# EAGLE design RT-E MainBoard Rev 1b (EAGLE 6.5.0)

## Sheet 1 of 4: Power
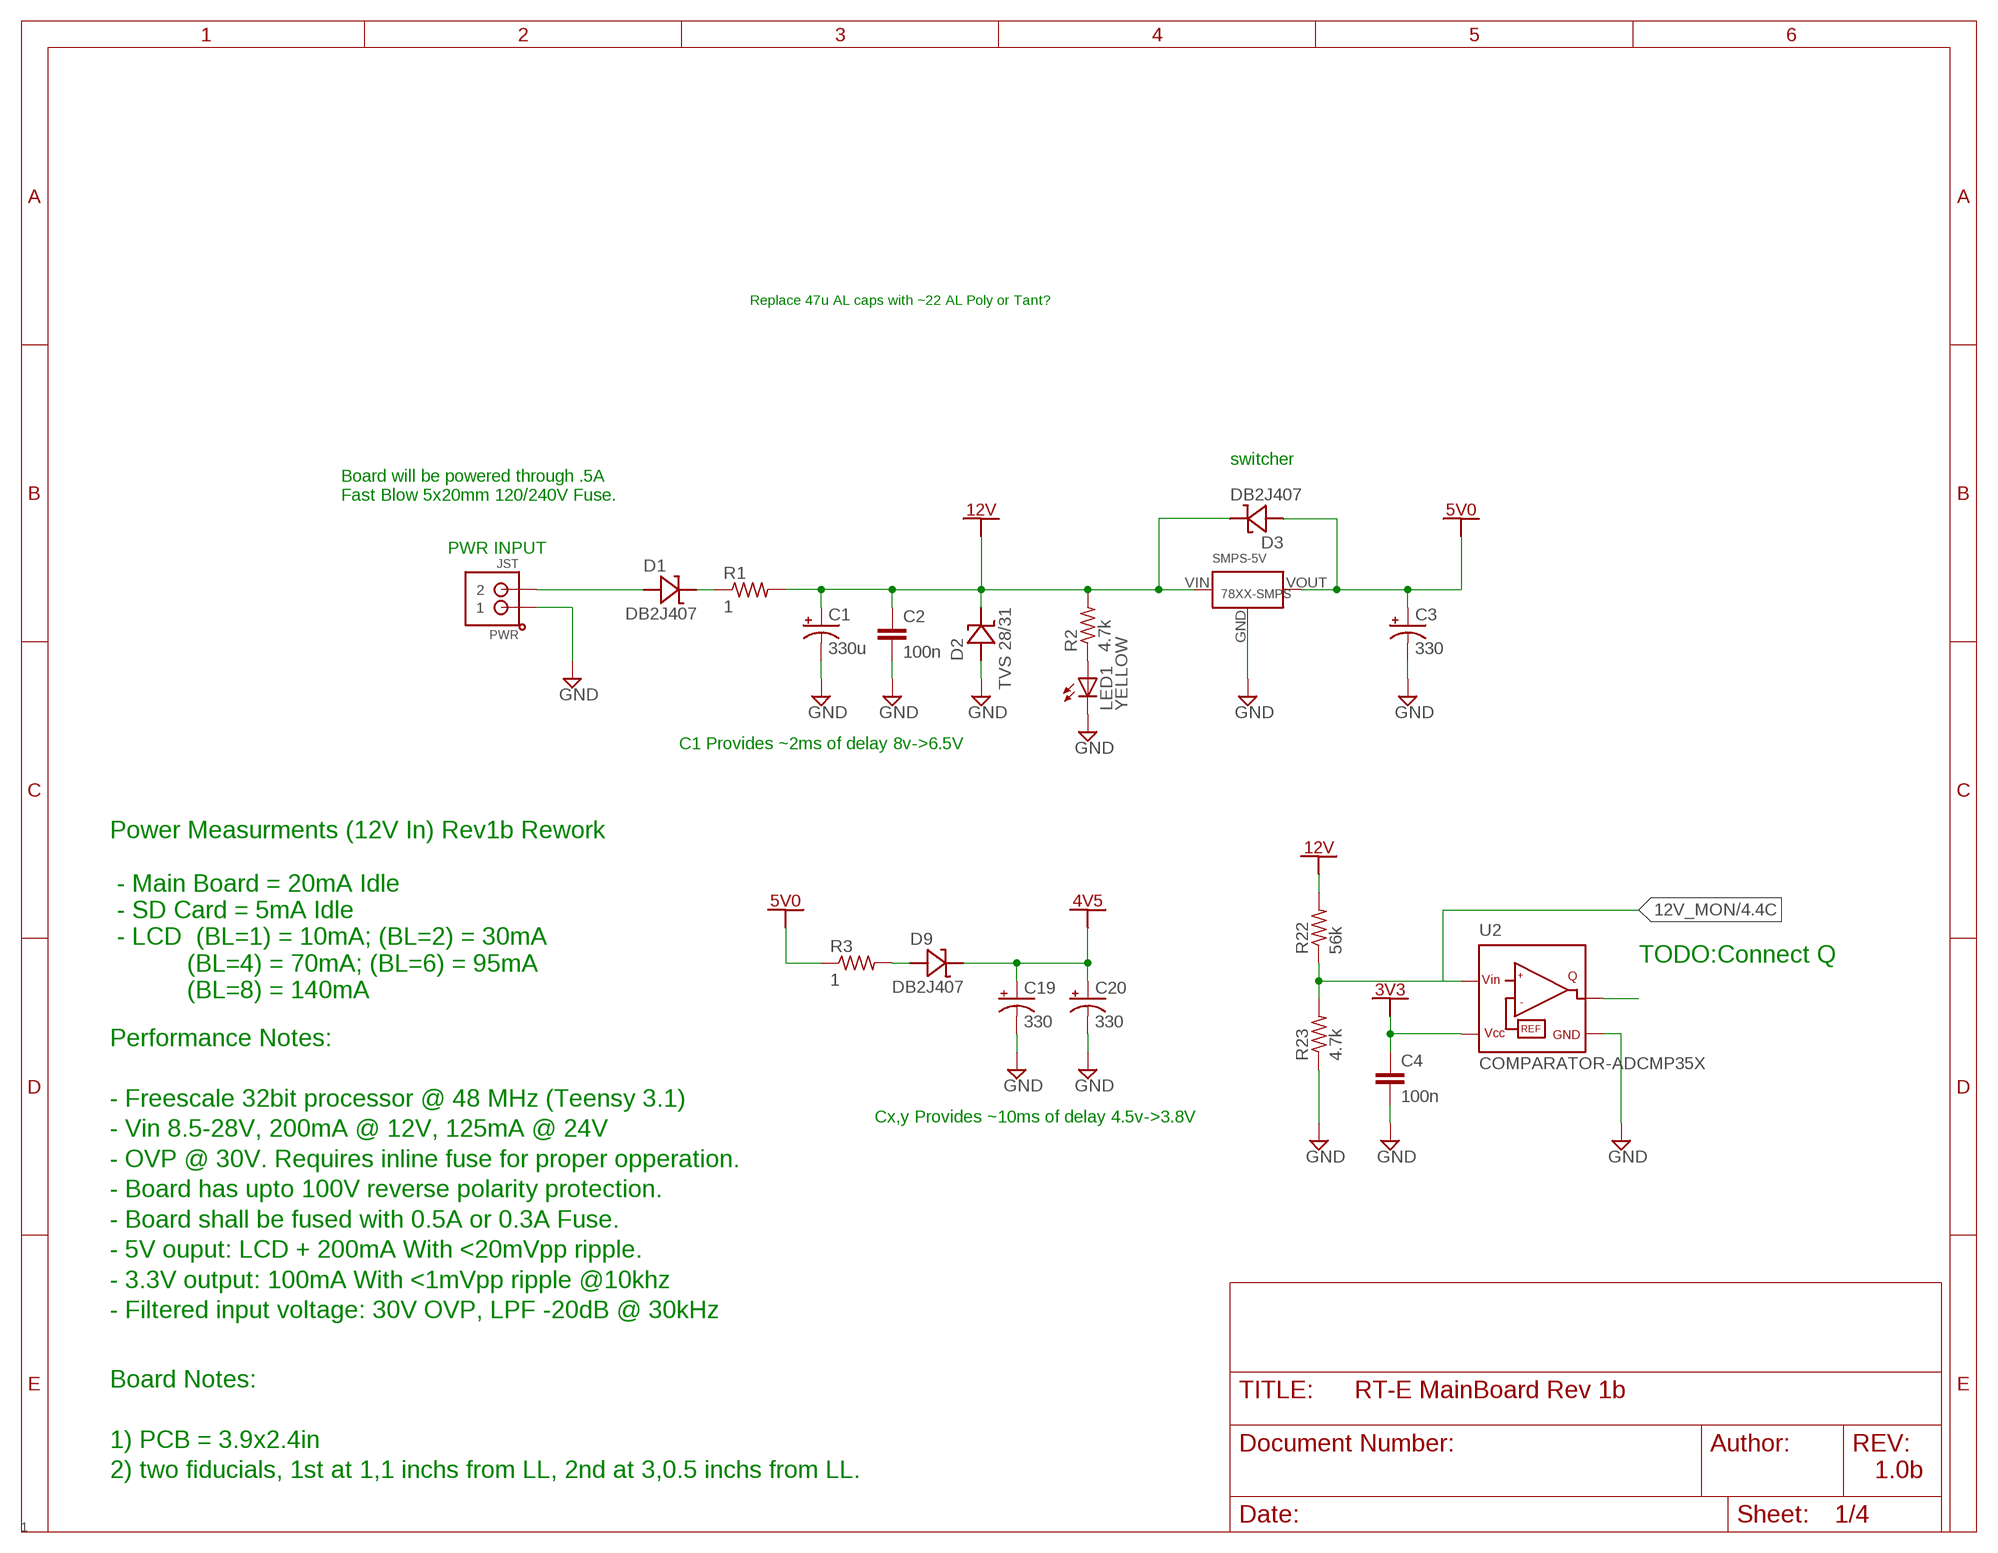
[diagram p0: schematic, sheet 1]
FRAME2 (FRAME_A_L): REV: 1

### Parts
C1  330u  CPOL-USE5-10.5  [E5-10,5]
C2  100n  C-EUC0603K  [C0603K]
C3  330  CPOL-USE2.5-7  [E2,5-7]
C4  100n  C-EUC0603K  [C0603K]
C19  330  CPOL-USE2.5-7  [E2,5-7]
C20  330  CPOL-USE2.5-7  [E2,5-7]
D1  DB2J407  DIODE-SCHOTTKYDB2J407  [SOD323R_INFINEON]
D2  TVS 28/31  DIODE-SCHOTTKY  [DO-214AC(SMA)]
D3  DB2J407  DIODE-SCHOTTKYDB2J407  [SOD323R_INFINEON]
D9  DB2J407  DIODE-SCHOTTKYDB2J407  [SOD323R_INFINEON]
LED1  YELLOW  LEDCHIP-LED0603  [CHIP-LED0603]
PWR  JST  JST-PH_2-PIN_HEADER  [JST_B2B-PH_HEADER]
R1  1  R-US_R1206  [R1206]
R2  4.7k  R-US_R0603  [R0603]
R3  1  R-US_R1206  [R1206]
R22  56k  R-US_R0603  [R0603]
R23  4.7k  R-US_R0603  [R0603]
SMPS-5V  78XX-SMPS  [78XX-SMPS]
U2  COMPARATOR-ADCMP35X  [SC70-4L]

### Nets
3V3: C4.1 C19.+ C20.+ D9.C U2.5(VCC) ; supply symbol labelled SUPPLY_3V3, SUPPLY_4V5 ; also sheet 2,3,4
5V0: C3.+ D3.A R3.1 SMPS-5V.VOUT ; supply symbol labelled SUPPLY_5V0 ; also sheet 2,3,4
12V: C1.+ C2.1 D2.P$1 D3.C R1.2 R2.2 R22.2 SMPS-5V.VIN ; supply symbol labelled SUPPLY_12V ; also sheet 2
GND: C1.- C2.2 C3.- C4.2 C19.- C20.- D2.P$2 LED1.C PWR.P1 R23.1 SMPS-5V.GND U2.3(GND) ; also sheet 2,3,4
N$1: D1.C R1.1
N$2: LED1.A R2.1
N$10: R22.1 R23.2 U2.1(VIN)
N$11: U2.4(OUT)
N$14: D9.A R3.2
N$20: D1.A PWR.P2

### Notes on the sheet
- Replace 47u AL caps with ~22 AL Poly or Tant?
- switcher
- Board will be powered through .5A 
  Fast Blow 5x20mm 120/240V Fuse.
- PWR INPUT
- C1 Provides ~2ms of delay 8v->6.5V
- TODO:Connect Q
- Power Measurments (12V In) Rev1b Rework
  
   - Main Board = 20mA Idle
   - SD Card = 5mA Idle
   - LCD  (BL=1) = 10mA; (BL=2) = 30mA
             (BL=4) = 70mA; (BL=6) = 95mA
             (BL=8) = 140mA
- Cx,y Provides ~10ms of delay 4.5v->3.8V
- Performance Notes:
  
  - Freescale 32bit processor @ 48 MHz (Teensy 3.1)
  - Vin 8.5-28V, 200mA @ 12V, 125mA @ 24V
  - OVP @ 30V. Requires inline fuse for proper opperation.
  - Board has upto 100V reverse polarity protection.
  - Board shall be fused with 0.5A or 0.3A Fuse.
  - 5V ouput: LCD + 200mA With <20mVpp ripple.
  - 3.3V output: 100mA With <1mVpp ripple @10khz
  - Filtered input voltage: 30V OVP, LPF -20dB @ 30kHz
- 1.0b
- Board Notes: 
  
  1) PCB = 3.9x2.4in
  2) two fiducials, 1st at 1,1 inchs from LL, 2nd at 3,0.5 inchs from LL.

## Sheet 2 of 4: Flow Inputs
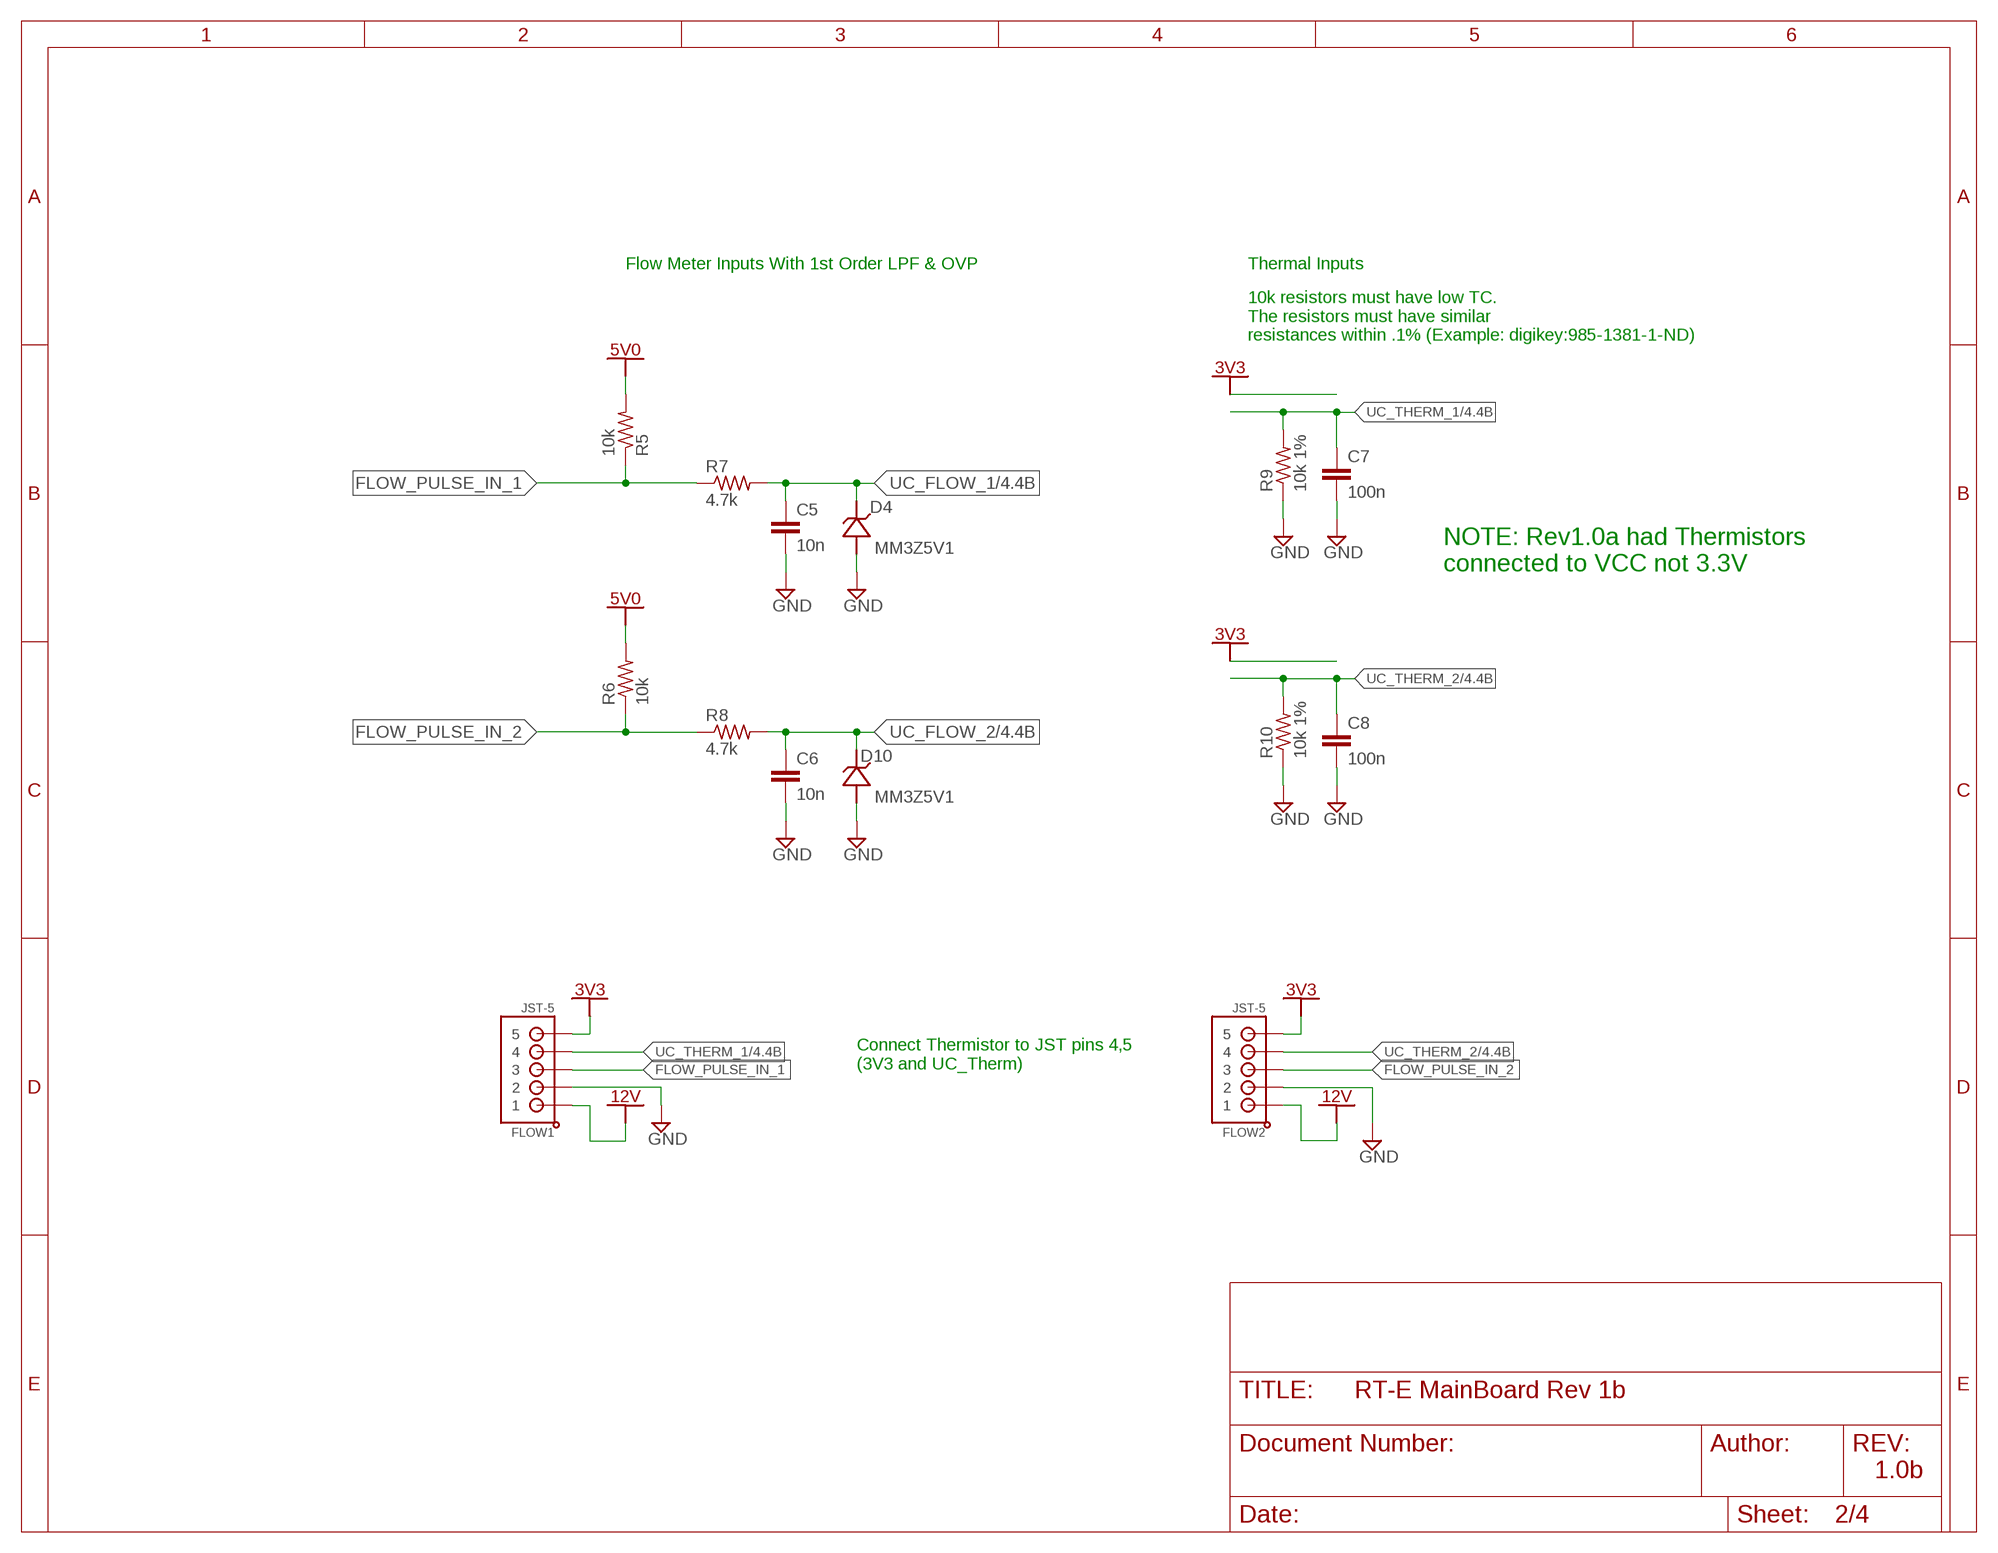
[diagram p1: schematic, sheet 2]

### Parts
C5  10n  C-EUC0603K  [C0603K]
C6  10n  C-EUC0603K  [C0603K]
C7  100n  C-EUC0603K  [C0603K]
C8  100n  C-EUC0603K  [C0603K]
D4  MM3Z5V1  DIODE-ZENER-MM3Z5V1  [SOD323R_INFINEON]
D10  MM3Z5V1  DIODE-ZENER-MM3Z5V1  [SOD323R_INFINEON]
FLOW1  JST-5  JST-PH_5-PIN_HEADERPH-2.0  [JST_B5B-PH_HEADER]
FLOW2  JST-5  JST-PH_5-PIN_HEADERPH-2.0  [JST_B5B-PH_HEADER]
R5  10k  R-US_R0603  [R0603]
R6  10k  R-US_R0603  [R0603]
R7  4.7k  R-US_R0603  [R0603]
R8  4.7k  R-US_R0603  [R0603]
R9  10k 1%  R-US_R0603  [R0603]
R10  10k 1%  R-US_R0603  [R0603]

### Nets
3V3: FLOW1.P5 FLOW2.P5 ; supply symbol labelled SUPPLY_3V3 ; also sheet 1,3,4
5V0: R5.2 R6.2 ; supply symbol labelled SUPPLY_5V0 ; also sheet 1,3,4
12V: FLOW1.P1 FLOW2.P1 ; supply symbol labelled SUPPLY_12V ; also sheet 1
FLOW_PULSE_IN_1: FLOW1.P3 R5.1 R7.1
FLOW_PULSE_IN_2: FLOW2.P3 R6.1 R8.1
GND: C5.2 C6.2 C7.2 C8.2 D4.A D10.A FLOW1.P2 FLOW2.P2 R9.1 R10.1 ; also sheet 1,3,4
UC_FLOW_1: C5.1 D4.C R7.2 ; also sheet 4
UC_FLOW_2: C6.1 D10.C R8.2 ; also sheet 4
UC_THERM_1: C7.1 FLOW1.P4 R9.2 ; also sheet 4
UC_THERM_2: C8.1 FLOW2.P4 R10.2 ; also sheet 4

### Notes on the sheet
- Flow Meter Inputs With 1st Order LPF & OVP | Thermal Inputs
- 10k resistors must have low TC. 
  The resistors must have similar 
  resistances within .1% (Example: digikey:985-1381-1-ND)
- NOTE: Rev1.0a had Thermistors 
  connected to VCC not 3.3V
- Connect Thermistor to JST pins 4,5
  (3V3 and UC_Therm)
- 1.0b

## Sheet 3 of 4: Other Sensors
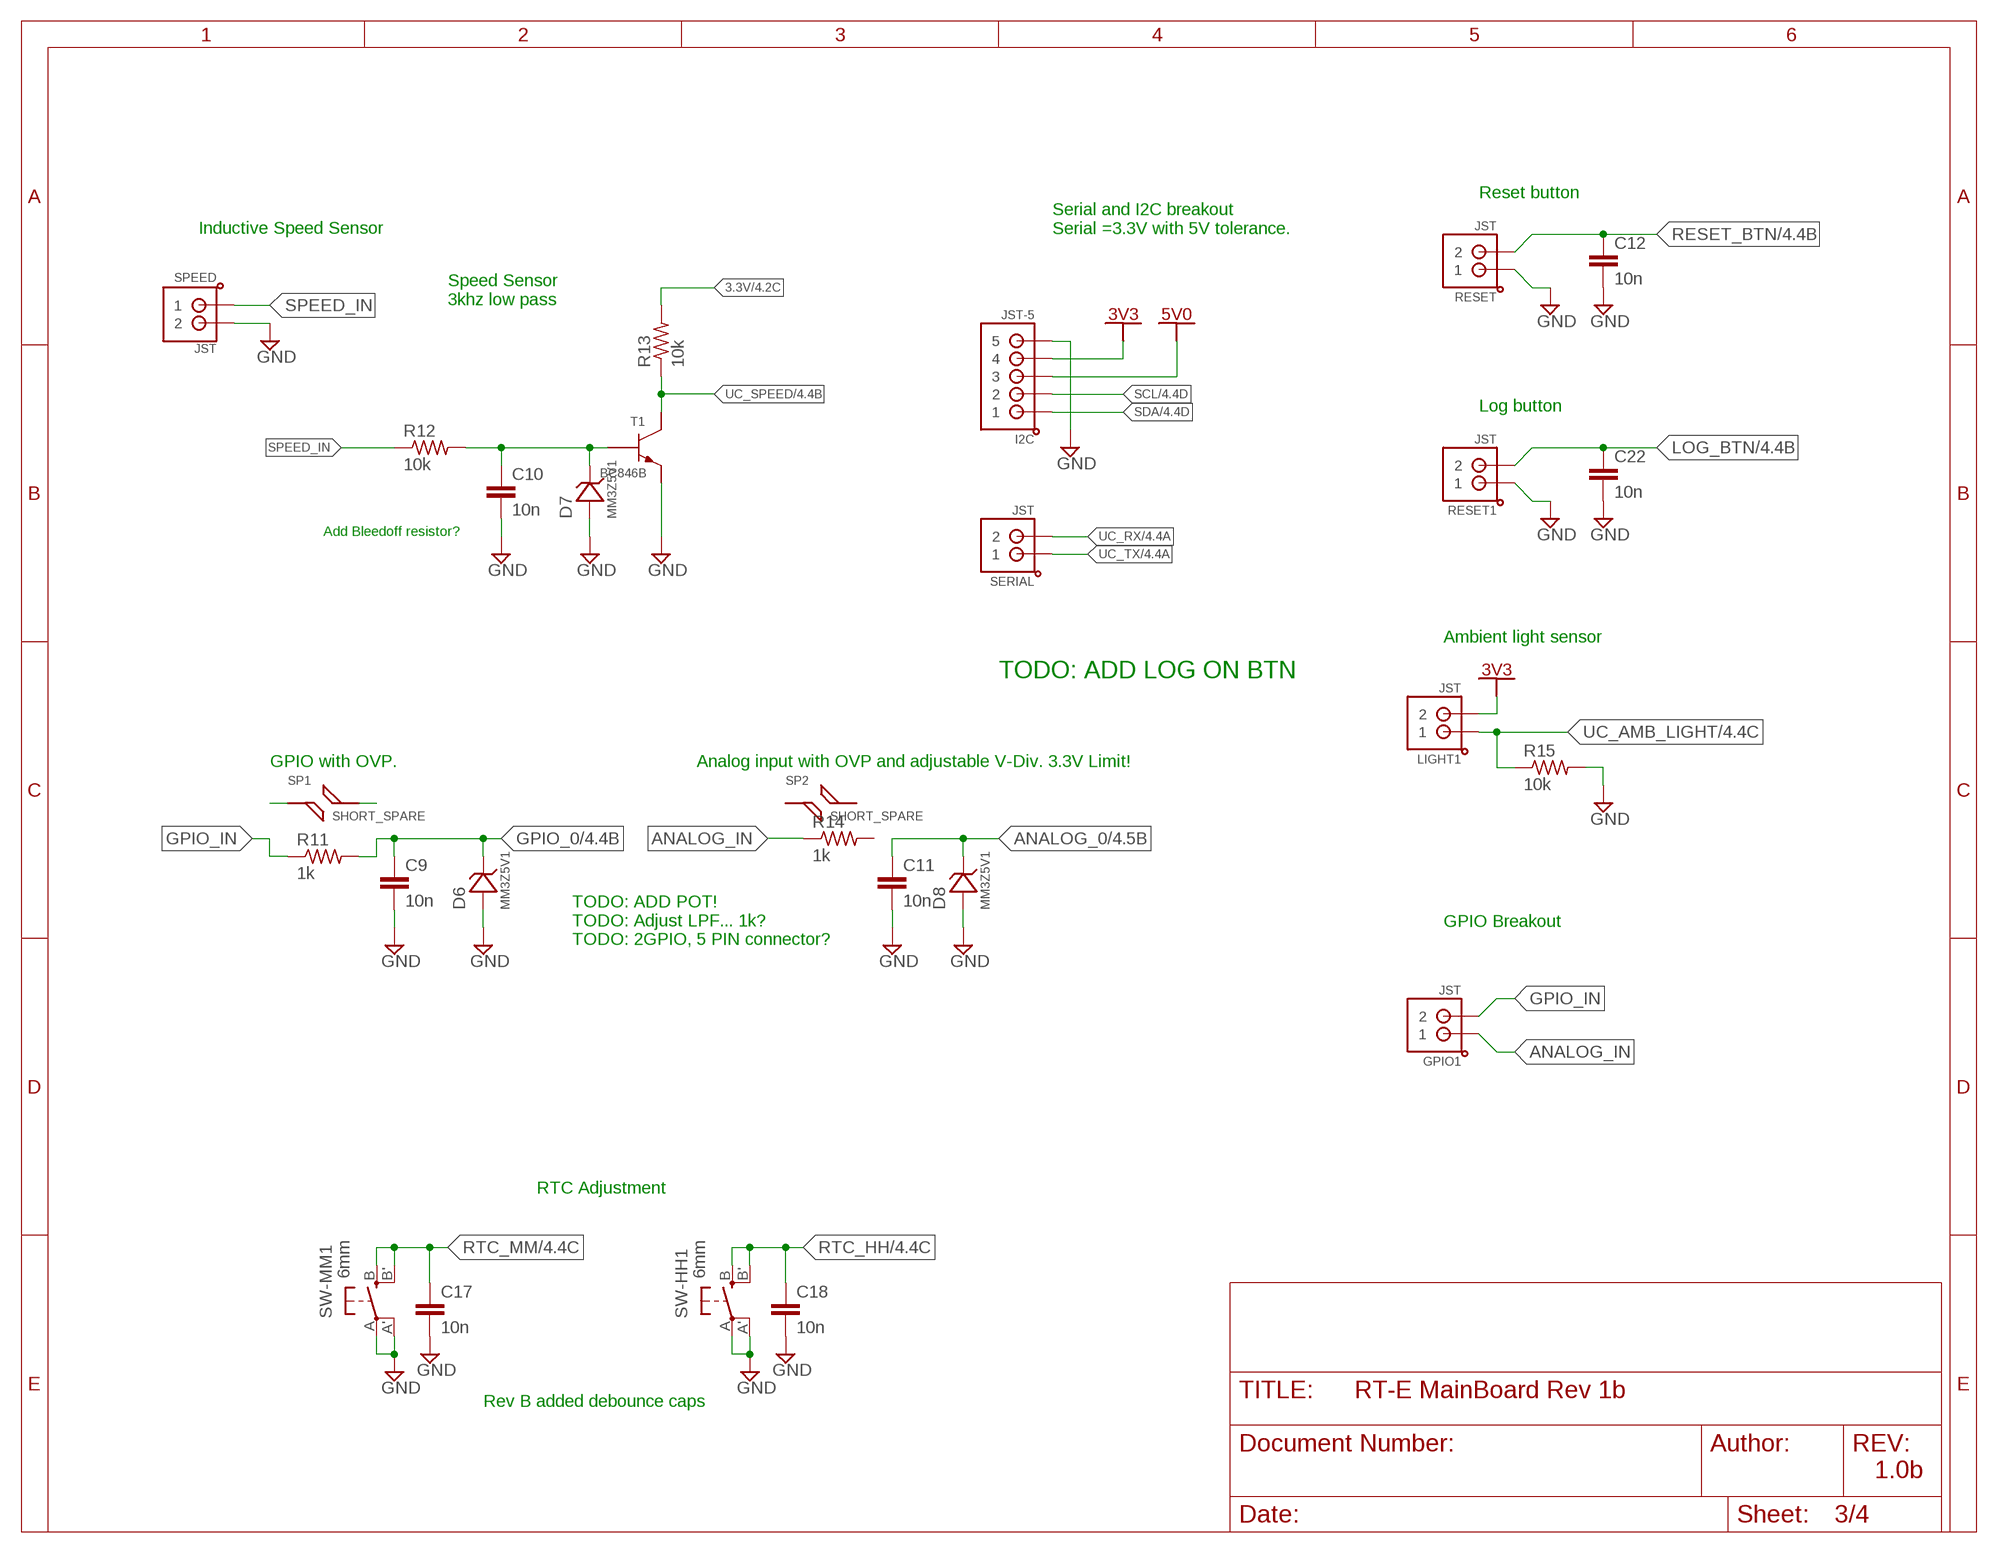
[diagram p2: schematic, sheet 3]

### Parts
C9  10n  C-EUC0603K  [C0603K]
C10  10n  C-EUC0603K  [C0603K]
C11  10n  C-EUC0603K  [C0603K]
C12  10n  C-EUC0603K  [C0603K]
C17  10n  C-EUC0603K  [C0603K]
C18  10n  C-EUC0603K  [C0603K]
C22  10n  C-EUC0603K  [C0603K]
D6  MM3Z5V1  ZENERSOD323  [SOD323-W]
D7  MM3Z5V1  ZENERSOD323  [SOD323-W]
D8  MM3Z5V1  ZENERSOD323  [SOD323-W]
GPIO1  JST  JST-PH_2-PIN_HEADER  [JST_B2B-PH_HEADER]
I2C  JST-5  JST-PH_5-PIN_HEADERPH-2.0  [JST_B5B-PH_HEADER]
LIGHT1  JST  JST-PH_2-PIN_HEADER  [JST_B2B-PH_HEADER]
R11  1k  R-US_R0603  [R0603]
R12  10k  R-US_R0603  [R0603]
R13  10k  R-US_R0603  [R0603]
R14  1k  R-US_R0603  [R0603]
R15  10k  R-US_R0603  [R0603]
RESET  JST  JST-PH_2-PIN_HEADER  [JST_B2B-PH_HEADER]
RESET1  JST  JST-PH_2-PIN_HEADER  [JST_B2B-PH_HEADER]
SERIAL  JST  JST-PH_2-PIN_HEADER  [JST_B2B-PH_HEADER]
SP1  SHORT_SPARE  [SHORT_0603]
SP2  SHORT_SPARE  [SHORT_0603]
SPEED  JST  JST-PH_2-PIN_HEADER  [JST_B2B-PH_HEADER]
SW-HH1  6mm  SPST_TACT-EVQQ2  [EVQ-Q2]
SW-MM1  6mm  SPST_TACT-EVQQ2  [EVQ-Q2]
T1  BC846B  BJT-NPNBC846  [BJT-BC846]

### Nets
3.3V: R13.2 ; also sheet 4
3V3: I2C.P4 LIGHT1.P2 ; supply symbol labelled SUPPLY_3V3 ; also sheet 1,2,4
5V0: I2C.P3 ; supply symbol labelled SUPPLY_5V0 ; also sheet 1,2,4
ANALOG_0: C11.1 D8.C ; also sheet 4
ANALOG_IN: GPIO1.P1 R14.1
GND: C9.2 C10.2 C11.2 C12.2 C17.2 C18.2 C22.2 D6.A D7.A D8.A I2C.P5 R15.2 RESET1.P1 RESET.P1 SPEED.P2 SW-HH1.A'(P1) SW-HH1.A(P) SW-MM1.A'(P1) SW-MM1.A(P) T1.E ; also sheet 1,2,4
GPIO_0: C9.1 D6.C R11.2 ; also sheet 4
GPIO_IN: GPIO1.P2 R11.1
LOG_BTN: C22.1 RESET1.P2 ; also sheet 4
N$4: SP1.2
N$9: C10.1 D7.C R12.2 T1.B
N$15: SP1.1
RESET_BTN: C12.1 RESET.P2 ; also sheet 4
RTC_HH: C18.1 SW-HH1.B'(S1) SW-HH1.B(S) ; also sheet 4
RTC_MM: C17.1 SW-MM1.B'(S1) SW-MM1.B(S) ; also sheet 4
SCL: I2C.P2 ; also sheet 4
SDA: I2C.P1 ; also sheet 4
SPEED_IN: R12.1 SPEED.P1
UC_AMB_LIGHT: LIGHT1.P1 R15.1 ; also sheet 4
UC_RX: SERIAL.P2 ; also sheet 4
UC_SPEED: R13.1 T1.C ; also sheet 4
UC_TX: SERIAL.P1 ; also sheet 4
Unconnected: R14.2 SP2.1 SP2.2

### Notes on the sheet
- Reset button
- Inductive Speed Sensor
- Serial and I2C breakout
  Serial =3.3V with 5V tolerance.
- Speed Sensor
  3khz low pass
- Log button
- Add Bleedoff resistor?
- Ambient light sensor
- TODO: ADD LOG ON BTN
- GPIO with OVP. | Analog input with OVP and adjustable V-Div. 3.3V Limit!
- GPIO Breakout
- TODO: ADD POT!
  TODO: Adjust LPF... 1k?
  TODO: 2GPIO, 5 PIN connector?
- RTC Adjustment
- Rev B added debounce caps
- 1.0b

## Sheet 4 of 4
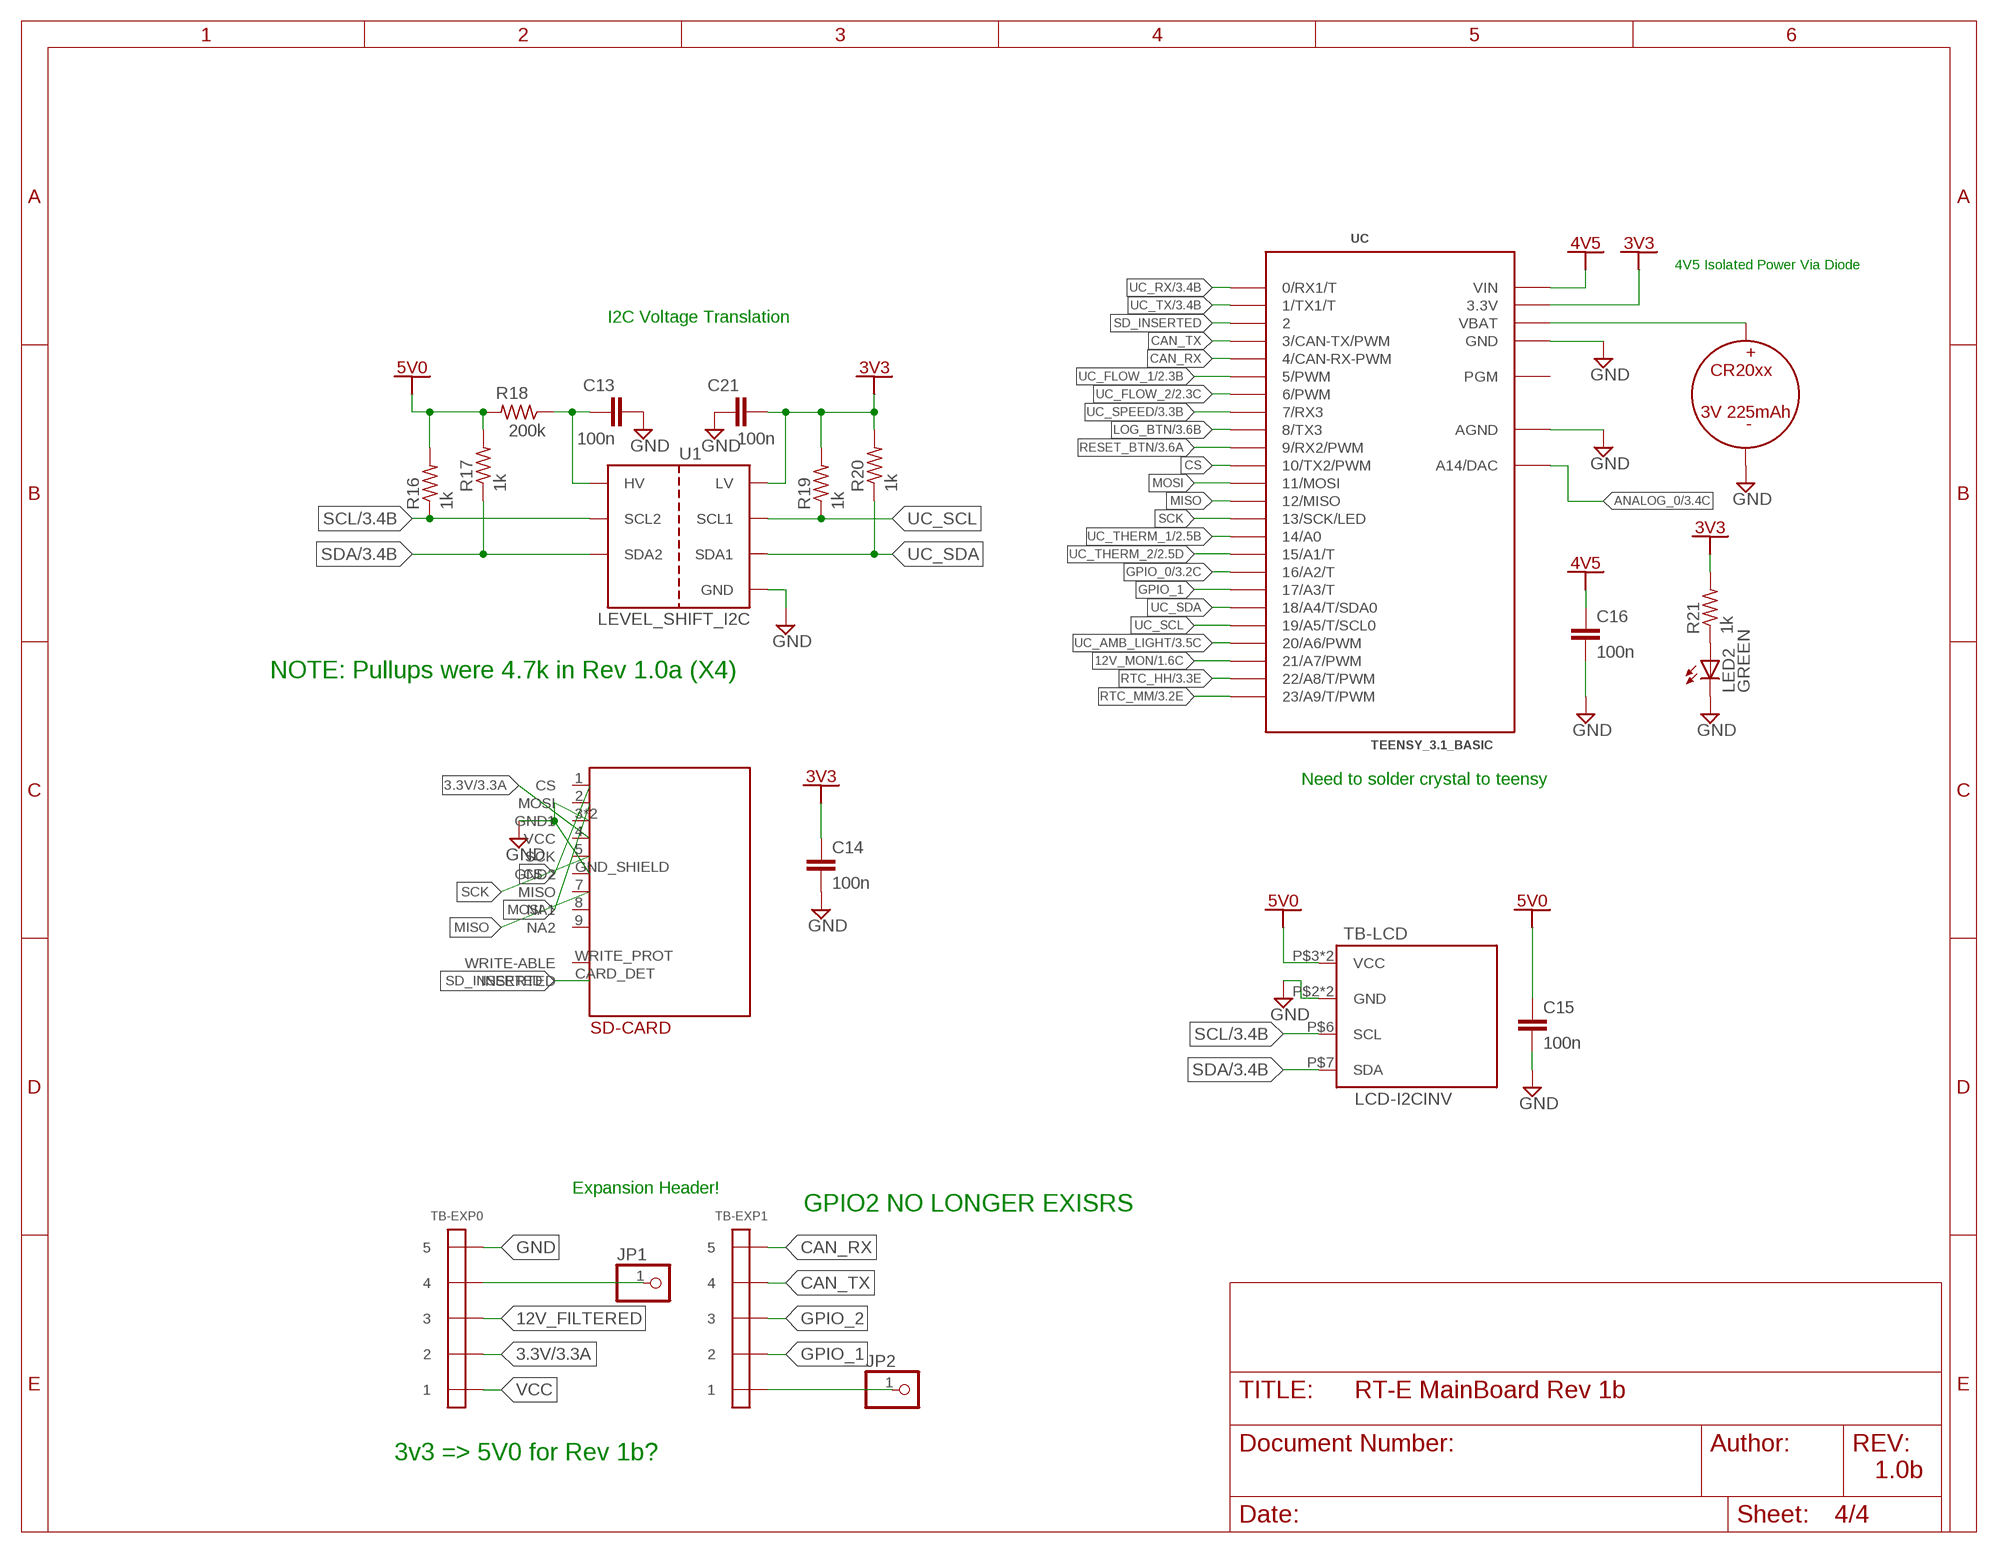
[diagram p3: schematic, sheet 4]

### Parts
BAT  3V_LITH_20MM  [COIN_CELL_HORZ_20MM]
C13  100n  C-EUC0603K  [C0603K]
C14  100n  C-EUC0603K  [C0603K]
C15  100n  C-EUC0603K  [C0603K]
C16  100n  C-EUC0603K  [C0603K]
C21  100n  C-EUC0603K  [C0603K]
JP1  PINHD-1X1CB  [1X01-CLEANBIG]
JP2  PINHD-1X1CB  [1X01-CLEANBIG]
LED2  GREEN  LEDCHIP-LED0603  [CHIP-LED0603]
R16  1k  R-US_R0603  [R0603]
R17  1k  R-US_R0603  [R0603]
R18  200k  R-US_R0603  [R0603]
R19  1k  R-US_R0603  [R0603]
R20  1k  R-US_R0603  [R0603]
R21  1k  R-US_R0603  [R0603]
SD-CARD  A101492CT-ND  SD-CARD-1(TC)  [SD-CARD-1]
TB-EXP0  EXPANSION_HEADER_5  [HEADER_1X5_2.54MM]
TB-EXP1  EXPANSION_HEADER_5  [HEADER_1X5_2.54MM]
TB-LCD  LCD-I2CINV  [LCD_I2C_INV]
U1  LEVEL_SHIFT_I2C  [SO08]
UC  TEENSY_3.1_BASIC  [TEENSY_3.1_BASIC]

### Nets
3.3V: SD-CARD.4(VCC) TB-EXP0.P$2 ; also sheet 3
3V3: C14.1 C21.2 R19.2 R20.2 R21.2 U1.2(LV) UC.3.3V UC.3.3V1(3.3V) ; supply symbol labelled SUPPLY_3V3 ; also sheet 1,2,3
4V5: C16.1 UC.VIN ; supply symbol labelled SUPPLY_4V5
5V0: C15.1 R16.2 R17.2 R18.2 TB-LCD.P$3(VCC) TB-LCD.P$9(VCC) ; supply symbol labelled SUPPLY_5V0 ; also sheet 1,2,3
12V_FILTERED: TB-EXP0.P$3
12V_MON: UC.21/A7(21/A7/PWM) ; also sheet 1
ANALOG_0: UC.A14(A14/DAC) ; also sheet 3
CAN_RX: TB-EXP1.P$5 UC.4(4/CAN-RX-PWM)
CAN_TX: TB-EXP1.P$4 UC.3(3/CAN-TX/PWM)
CS: SD-CARD.1(CS) UC.10(10/TX2/PWM)
GND: BAT.NEG(-) C13.2 C14.2 C15.2 C16.2 C21.1 LED2.C SD-CARD.3(GND1) SD-CARD.6(GND1) SD-CARD.GND_SHIELD(GND2) TB-EXP0.P$5 TB-LCD.P$2(GND) TB-LCD.P$8(GND) U1.1(GND) UC.AGND UC.GND UC.GND1(GND) ; also sheet 1,2,3
GPIO_0: UC.16/A2(16/A2/T) ; also sheet 3
GPIO_1: TB-EXP1.P$2 UC.17/A3(17/A3/T)
GPIO_2: TB-EXP1.P$3
LOG_BTN: UC.8(8/TX3) ; also sheet 3
MISO: SD-CARD.7(MISO) UC.12(12/MISO)
MOSI: SD-CARD.2(MOSI) UC.11(11/MOSI)
N$3: LED2.A R21.1
N$5: JP1.1 TB-EXP0.P$4
N$6: C13.1 R18.1 U1.7(HV) U1.8(HV)
N$7: BAT.POS(+) UC.VBAT
N$8: JP2.1 TB-EXP1.P$1
RESET_BTN: UC.9(9/RX2/PWM) ; also sheet 3
RTC_HH: UC.22/A8(22/A8/T/PWM) ; also sheet 3
RTC_MM: UC.23/A9(23/A9/T/PWM) ; also sheet 3
SCK: SD-CARD.5(SCK) UC.13(13/SCK/LED)
SCL: R16.1 TB-LCD.P$6(SCL) U1.6(SCL2) ; also sheet 3
SD_INSERTED: SD-CARD.CARD_DET(INSERTED) UC.2
SDA: R17.1 TB-LCD.P$7(SDA) U1.5(SDA2) ; also sheet 3
UC_AMB_LIGHT: UC.20/A6(20/A6/PWM) ; also sheet 3
UC_FLOW_1: UC.5(5/PWM) ; also sheet 2
UC_FLOW_2: UC.6(6/PWM) ; also sheet 2
UC_RX: UC.0(0/RX1/T) ; also sheet 3
UC_SCL: R19.1 U1.3(SCL1) UC.19/A5(19/A5/T/SCL0)
UC_SDA: R20.1 U1.4(SDA1) UC.18/A4(18/A4/T/SDA0)
UC_SPEED: UC.7(7/RX3) ; also sheet 3
UC_THERM_1: UC.14/A0 ; also sheet 2
UC_THERM_2: UC.15/A1(15/A1/T) ; also sheet 2
UC_TX: UC.1(1/TX1/T) ; also sheet 3
VCC: TB-EXP0.P$1
Unconnected: SD-CARD.8(NA1) SD-CARD.9(NA2) SD-CARD.WRITE_PROT(WRITE-ABLE) UC.PGM

### Notes on the sheet
- 4V5 Isolated Power Via Diode
- I2C Voltage Translation
- NOTE: Pullups were 4.7k in Rev 1.0a (X4)
- Need to solder crystal to teensy
- Expansion Header!
- GPIO2 NO LONGER EXISRS
- 3v3 => 5V0 for Rev 1b? | 1.0b

## Library data of the parts
BAT = CTM_Custom_SMD:3V_LITH_20MM: P657-ND
C1 C3 C19 C20 = rcl:CPOL-US: POLARIZED CAPACITOR, American symbol
C2 C4-C18 C21 C22 = rcl:C-EU: CAPACITOR, European symbol
D1 D3 D9 = RT-E:DIODE-SCHOTTKY: DIODE SCHOTTKY 40V 500MA SMA: SS110-TPCT-ND SOD-323: DB2J40700LCT-ND
D2 = MSOE_Senior_Design_CM:DIODE-SCHOTTKY
D4 D10 = RT-E:DIODE-ZENER-MM3Z5V1
D6-D8 = CTM_Custom_SMD:ZENER: Low Power Zener 5.1V option SOD323:MM3Z5V1ST1G
FLOW1 FLOW2 I2C = CTM-TERM:JST-PH_5-PIN_HEADER: 5-pin JST PH Shrouded Header, top entry P/N B5B-PH-K-S Mating connector PHR-5 Mating cable assembly: Sparkfun PRT-09917 <http://www.sparkfun.com/products/9917>
GPIO1 LIGHT1 PWR RESET RESET1 SERIAL SPEED = CTM-TERM:JST-PH_2-PIN_HEADER: 2-pin JST PH Shrouded Header, top entry P/N B2B-PH-K-S Mating connector PHR-2 Mating cable assembly: Sparkfun PRT-09914 <http://www.sparkfun.com/products/9914>
JP1 JP2 = adafruit:PINHD-1X1: Pin header 1x1 for 0.1" spacing With round pins
LED1 LED2 = adafruit:LED: LED OSRAM: - CHIPLED LG R971, LG N971, LY N971, LG Q971, LY Q971, LO R971, LY R971 LH N974, LH R974 LS Q976, LO Q976, LY Q976 LO Q996 - Hyper CHIPLED LW Q18S LB Q993, LB Q99A, LB R99A - SideLED LS A670, LO A670, LY A670, LG A670, LP A670 LB A673, LV A673, LT A673, LW A673 LH A674 LY A675 LS A676, LA A676, LO A676, LY A676, LW A676 LS A679, LY A679, LG A679 - Hyper Micro SIDELED® LS Y876, LA Y876, LO Y876, LY Y876 LT Y87S - SmartLED LW L88C, LW L88S LB L89C, LB L89S, LG L890 LS L89K, LO L89K, LY L89K LS L896, LA L896, LO L896, LY L896 - TOPLED LS T670, LO T670, LY T670, LG T670, LP T670 LSG T670, LSP T670, LSY T670, LOP T670, LYG T670 LG T671, LOG T671, LSG T671 LB T673, LV T673, LT T673, LW T673 LH T674 LS T676, LA T676, LO T676, LY T676, LB T676, LH T676, LSB T676, LW T676 LB T67C, LV T67C, LT T67C, LS T67K, LO T67K, LY T67K, LW E67C LS E67B, LA E67B, LO E67B, LY E67B, LB E67C, LV E67C, LT E67C LW T67C LS T679, LY T679, LG T679 LS T770, LO T770, LY T770, LG T770, LP T770 LB T773, LV T773, LT T773, LW T773 LH T774 LS E675, LA E675, LY E675, LS T675 LS T776, LA T776, LO T776, LY T776, LB T776 LHGB T686 LT T68C, LB T68C - Hyper Mini TOPLED® LB M676 - Mini TOPLED Santana® LG M470 LS M47K, LO M47K, LY M47K Source: http://www.osram.convergy.de/
R1-R3 R5-R23 = rcl:R-US_: RESISTOR, American symbol
SD-CARD = CTM_Custom_SMD:SD-CARD-1(TC)
SMPS-5V = CTM_Custom_SMD:78XX-SMPS
SP1 SP2 = RT-E:SHORT_SPARE: Short With Solder. 1/2 the pin distance of 603 package.
SW-HH1 SW-MM1 = adafruit:SPST_TACT: SMT 6mm switch, EVQQ2 series http://www.ladyada.net/library/eagle
T1 = CTM_Custom_SMD:BJT-NPN: 568-1632-6-ND
TB-EXP0 TB-EXP1 = CTM-TERM:EXPANSION_HEADER_5
TB-LCD = CTM-TERM:LCD-I2C
U1 = CTM_Custom_SMD:LEVEL_SHIFT_I2C: I2C 5.0V to 3.3V bi-direciton level shift. PCA9306.
U2 = RT-E:COMPARATOR-ADCMP35X: Comparator with internal 0.6V reference and ~15mV hysteresis. Comes in push/pull or open collector. ADCMP354YKSZ-REEL7 ADCMP356YKSZ-REEL7
UC = Teensy_3_Series_Board_v1.0:TEENSY_3.1_BASIC: Footprint for Teensy 3.1 board using all pin connections on the outer perimeter

## Board
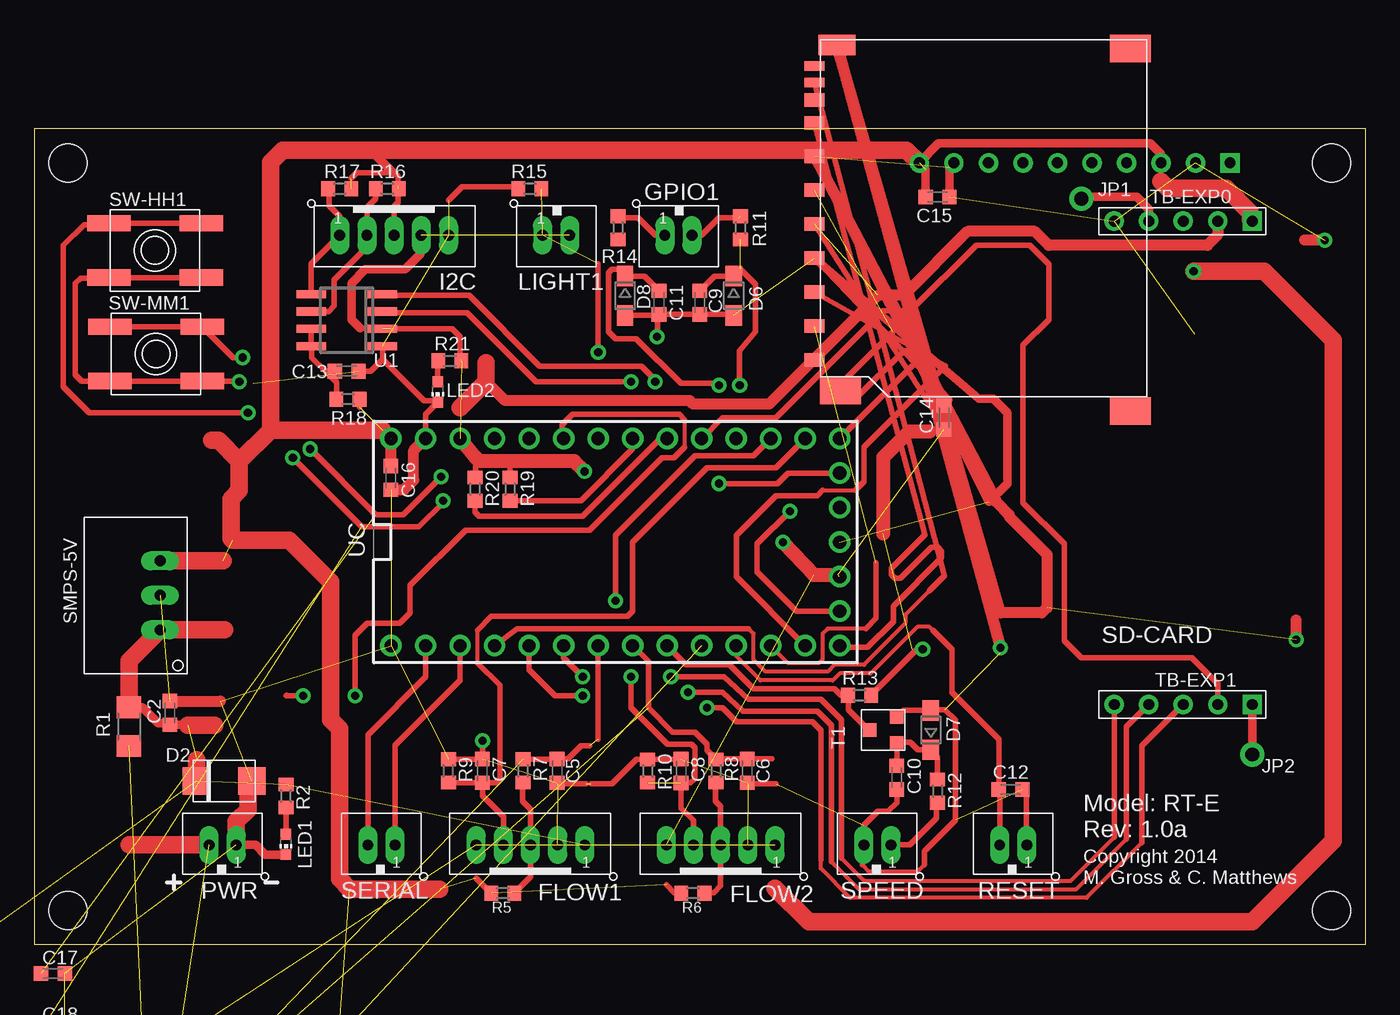
[diagram p4: board, top side]
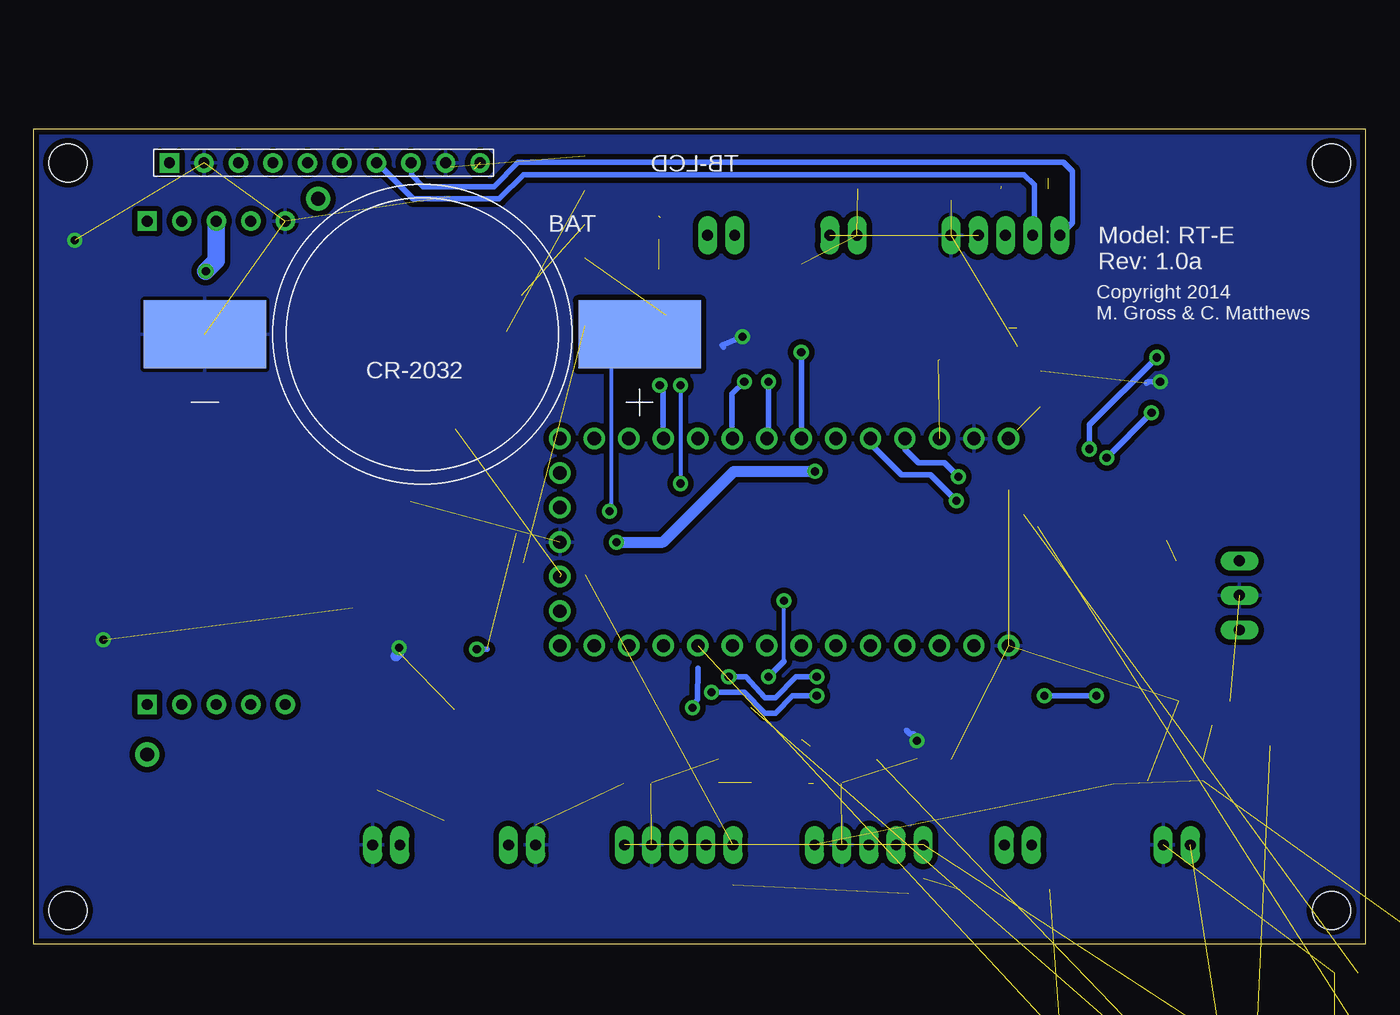
[diagram p5: board, bottom side, seen from below]

Size 98 x 60 mm. Coordinates in mm from the lower left corner, seen from the top.
Outline: 0,0 98,0 98,60 0,60 0,0
Copper layers (1*16): Top 0.035mm / dielectric 1.5mm / Bottom 0.035mm
Design rules "SparkFun": minimum track width 8mil, minimum drill 20mil, track to track 8mil, track to pad 8mil, pad to pad 8mil, via to via 8mil, smd to smd 8mil, copper to edge 10mil, drill to drill 8mil, minimum pad ring 12mil, minimum via ring 10mil, stop-mask expansion 4mil, vias tented up to drill 25mil, thermal gap 10mil
Holes 2.8 mm at 2.5,2.5 2.5,57.5 95.5,57.5 95.5,2.5

### Footprints (pad centres in the part's own frame; a part is rotated, then mirrored left to right if it is on the bottom)
COIN_CELL_HORZ_20MM = smd 9 x 5: NEG 16,0; POS -16,0
E5-10,5 = drill 1.016 pad 2.54: + -2.54,0 | drill 1.016 pad 2.54 octagon: - 2.54,0
C0603K = smd 1.05 x 1.08: 1 -0.875,0; 2 0.875,0
E2,5-7 = drill 0.813 pad 1.6: + -1.27,0 | drill 0.813 pad 1.6 octagon: - 1.27,0
SOD323R_INFINEON = smd 0.8 x 0.6: A 1.25,0; C -1.25,0
DO-214AC(SMA) = smd 2.032 x 2.032: P$1 -2.032,0; P$2 2.032,0
SOD323-W = smd 1.5 x 1.2: A 1.45,0; C -1.45,0
JST_B5B-PH_HEADER = drill 0.8 long: P1 4,0.048; P2 2,0.048; P3 0,0.048; P4 -2,0.048; P5 -4,0.048
JST_B2B-PH_HEADER = drill 0.8 long: P1 1.075,0.048; P2 -0.925,0.048
1X01-CLEANBIG = drill 1.016 pad 1.778: 1 0,0
CHIP-LED0603 = smd 0.8 x 0.8: A 0,-0.75; C 0,0.75
R1206 = smd 1.6 x 1.803: 1 -1.422,0; 2 1.422,0
R0603 = smd 1 x 1.1: 1 -0.85,0; 2 0.85,0
SD-CARD-1 = smd 1 x 1.5: 1 7.32,24.76; 2 9.82,24.76; 3 12.32,24.76; 4 14.82,24.76; 5 17.32,24.76; 6 19.82,24.76; 7 22.25,24.76; 8 23.95,24.76; 9 4.82,24.76 | smd 0.7 x 1.5: CARD_DET 25.25,24.76; WRITE_PROT 26.45,24.76 | smd 1.5 x 2.75: GND_SHIELD 28,23.1 | smd 2.046 x 3.004: GND_SHIELD1 27.746,1.51; GND_SHIELD2 1.076,1.51; GND_SHIELD3 2.6,22.846
78XX-SMPS = drill 0.8 long: GND 0,-1.8; VIN -2.54,-1.8; VOUT 2.54,-1.8
SHORT_0603 = smd 1.05 x 1.08: 1 -0.621,0; 2 0.875,0
EVQ-Q2 = smd 3.2 x 1.2: A -3.4,-2; A' 3.4,-2; B -3.4,2; B' 3.4,2
BJT-BC846 = smd 1 x 1: B -0.95,-1; C 0,1; E 0.95,-1
HEADER_1X5_2.54MM = drill 0.8 pad 1.422 square: P$1 -5.08,0 | drill 0.8 pad 1.422: P$2 -2.54,0; P$3 0,0; P$4 2.54,0; P$5 5.08,0
LCD_I2C_INV = drill 0.8 pad 1.422: NC 3.81,0; P$2 8.89,0; P$3 6.35,0; P$4 1.27,0; P$5 -1.27,0; P$6 -3.81,0; P$7 -6.35,0; P$8 -8.89,0; P$9 -11.43,0 | drill 0.8 pad 1.422 square: P$1 11.43,0
SO08 = smd 0.6 x 2.2: 1 -1.905,-2.6; 2 -0.635,-2.6; 3 0.635,-2.6; 4 1.905,-2.6; 5 1.905,2.6; 6 0.635,2.6; 7 -0.635,2.6; 8 -1.905,2.6
SC70-4L = smd 0.35 x 0.8: 1 -0.65,-0.85; 4 0.65,0.85; 5 -0.65,0.85 | smd 0.8 x 0.8: 3 0.55,-0.85
TEENSY_3.1_BASIC = drill 0.965: 0 -7.62,13.97; 1 -7.62,11.43; 2 -7.62,8.89; 3 -7.62,6.35; 3.3V 7.62,11.43; 3.3V1 -2.54,-16.51; 4 -7.62,3.81; 5 -7.62,1.27; 6 -7.62,-1.27; 7 -7.62,-3.81; 8 -7.62,-6.35; 9 -7.62,-8.89; 10 -7.62,-11.43; 11 -7.62,-13.97; 12 -7.62,-16.51; 13 7.62,-16.51; 14/A0 7.62,-13.97; 15/A1 7.62,-11.43; 16/A2 7.62,-8.89; 17/A3 7.62,-6.35; 18/A4 7.62,-3.81; 19/A5 7.62,-1.27; 20/A6 7.62,1.27; 21/A7 7.62,3.81; 22/A8 7.62,6.35; 23/A9 7.62,8.89; A14 5.08,-16.51; AGND 7.62,13.97; GND -7.62,16.51; GND1 0,-16.51; PGM 2.54,-16.51; VBAT -5.08,-16.51; VIN 7.62,16.51

### Placement (x,y rotation side)
BAT  69.42,44.89 180 bottom
C1  -10.06,-5.54 0 top  (outside the outline)
C2  10,17.03 90 top
C3  -11.71,-14.43 0 top  (outside the outline)
C4  -18.92,-20.12 0 top  (outside the outline)
C5  38.5,12.77 270 top
C6  52.5,12.77 270 top
C7  33,12.77 90 top
C8  47.62,12.76 90 top
C9  49,47.22 270 top
C10  63.5,12.27 270 top
C11  46,47.22 270 top
C12  71.87,11.39 0 top
C13  23.01,42.17 0 top
C14  66.97,38.76 90 top
C15  66.5,55 0 top
C16  26.27,34.32 270 top
C17  1.4,-2.13 0 top
C18  1.4,-6.3 0 top  (outside the outline)
C19  0.25,-14.53 0 top  (outside the outline)
C20  0.25,-21.95 0 top  (outside the outline)
C21  -1.75,-33.66 0 top  (outside the outline)
C22  -18.92,-55.07 0 top  (outside the outline)
D1  9.3,-7.77 0 top  (outside the outline)
D2  14,12.02 0 top
D3  19.2,-33.22 0 top  (outside the outline)
D4  -18.26,-44.15 0 top  (outside the outline)
D6  51.5,47.72 270 top
D7  66,15.77 90 top
D8  43.5,47.72 270 top
D9  -18.26,-34.24 0 top  (outside the outline)
D10  -18.26,-39.19 0 top  (outside the outline)
FLOW1  36.54,7.27 0 top
FLOW2  50.54,7.27 0 top
GPIO1  47.5,52.22 180 top
I2C  26.5,52.22 180 top
JP1  77.09,54.86 0 top
JP2  89.66,13.97 0 top
LED1  18.54,7.37 180 top
LED2  29.72,40.64 180 top
LIGHT1  38.5,52.22 180 top
PWR  13.82,7.27 0 top
R1  7,16.02 90 top
R2  18.54,10.92 90 top
R3  -0.74,-28.6 0 top  (outside the outline)
R5  34.5,3.77 180 top
R6  48.5,3.77 180 top
R7  36,12.77 90 top
R8  50.2,12.76 90 top
R9  30.5,12.77 270 top
R10  45.17,12.76 270 top
R11  52,52.72 270 top
R12  66.5,11.27 90 top
R13  60.76,18.33 0 top
R14  43,52.72 270 top
R15  36.5,55.59 180 top
R16  26,55.59 0 top
R17  22.5,55.59 0 top
R18  23.12,40.12 0 top
R19  35.05,33.49 90 top
R20  32.47,33.49 90 top
R21  30.61,42.93 0 top
R22  -18.92,-24.61 0 top  (outside the outline)
R23  -18.92,-29.36 0 top  (outside the outline)
RESET  72,7.27 0 top
RESET1  -16.99,-50.44 0 top  (outside the outline)
SD-CARD  82.2,38.17 90 top
SERIAL  25.5,7.27 0 top
SMPS-5V  7.48,25.68 90 top
SP1  -19.1,-59.23 0 top  (outside the outline)
SP2  -19.1,-63.4 0 top  (outside the outline)
SPEED  62,7.27 0 top
SW-HH1  8.9,51.06 0 top
SW-MM1  8.98,43.44 0 top
T1  62.5,15.77 90 top
TB-EXP0  84.58,53.21 180 top
TB-EXP1  84.58,17.65 180 top
TB-LCD  76.6,57.5 0 top
U1  23.01,45.92 90 top
U2  -18.72,-15.24 0 top  (outside the outline)
UC  42.79,29.6 90 top

### Tracks (layer width: path | path; a pad name or v marks a point on that pad's centre or on a via)
3.3V  (via drill 0.6)  (2 unrouted)
  Top 0.406: SD-CARD.4 67.3,37.56 67.09,37.56 66.93,37.72 65.91,37.72 | 33.15,42.93 33.27,42.8 | v65.41,21.72 64.99,21.72 R13.2
  Top 0.813: TB-EXP0.P$2 87.12,52.2 86.36,51.44 74.68,51.44 73.66,52.45 68.71,52.45 64.01,47.75 62.1,47.75 54.1,39.75 48.51,39.75 48.26,40.01 34.67,40.01 33.27,41.4
  Top 1.016: 65.91,37.72 64.39,37.72 62.48,35.81 62.48,30.25
  Top 1.27: 31.36,39.49 33.27,41.4 33.27,42.8
  Bottom 0.406: v65.41,21.72 64.64,21.72
3V3  (via drill 0.6)  (15 unrouted)
  Top 0.406: 32.51,35.81 32.51,34.39 R20.2 | R19.2 35.05,35.44 34.92,35.56 | 25.66,45.34 U1.2 | 28.45,52.12 I2C.P4 | 31.37,43.01 31.37,44.7 30.78,45.29 26.29,45.29 26.24,45.34 24,45.34
  Top 0.61: 28.45,52.12 28.45,50.8 27.3,49.66 24.38,49.66 23.37,48.64 23.37,45.97 24,45.34
  Top 1.016: UC.3.3V 32.51,35.81 32.77,35.56 34.92,35.56 39.75,35.56 v40.51,34.8 | v55.12,29.59 57.4,27.18 59.18,27.18
  Bottom 0.813: UC.3.3V1 | v55.12,29.59 51.69,29.59 46.48,34.8 v40.51,34.8
4V5  (1 unrouted)
  Top 0.813: C16.1 UC.VIN
5V0  (11 unrouted)
  Top 0.406: R18.2 23.97,39.53 | 23.35,56.37 23.75,56.77 26.42,56.77 26.54,56.77 26.8,56.52 26.8,55.77 | 32.54,4.88 R5.2 | 46.54,4.38 47.12,3.81 47.61,3.81 R6.2 | I2C.P3 26.5,54.31 26.8,54.61 26.8,55.67
  Top 0.61: 18.29,58.42 24.77,58.42 26.42,56.77 | TB-LCD.P$3 82.92,58.18 82.17,58.93 66.57,58.93 TB-LCD.P$9 | C15.1 65.62,57.02
  Top 1.27: SMPS-5V.VOUT 13.94,28.22 | 15.11,35.56 15.11,33.4 14.5,32.79 14.5,29.84 14.63,29.72 18.8,29.72 21.84,26.67 21.84,16.51 22.48,15.88 22.48,4.83 23.24,4.06 29.84,4.06 | 15.11,35.56 13.59,37.08 13.08,37.08 | 17.4,37.85 17.4,57.53 18.29,58.42 64.22,58.42 TB-LCD.P$9 | 17.4,37.85 15.11,35.56 | 17.4,37.85 25.65,37.85
12V  (7 unrouted)
  Top 0.61: R1.2 7.95,17.45 9.14,16.26 9.9,16.26 C2.1 11.15,16.16 11.3,16.13
  Top 1.27: D2.P$1 11.97,13.6 | 11.3,16.13 13.3,16.13 | R1.2 7,20.86 SMPS-5V.VIN 14.04,23.14
12V_FILTERED  (via drill 0.6)
  Top 1.27: 54.54,4.13 57.02,1.65 89.66,1.65 95.63,7.62 95.63,44.45 90.55,49.53 v85.34,49.53
  Bottom 1.27: TB-EXP0.P$3 84.58,50.29 v85.34,49.53
12V_MON  (via drill 0.6)
  Top 0.305: 47.88,38.61 47.88,36.58
  Top 0.406: 18.6,18.35 18.54,18.29 v19.81,18.29 | v23.62,18.29 23.62,21.97 23.62,22.35 23.62,22.73 24.51,23.62 26.92,23.62 27.69,24.38 27.69,26.42 31.75,30.48 40.89,30.48 46.23,35.81 47.12,35.81 47.88,36.58 | 47.88,38.61 47.5,38.99 39.62,38.99 38.86,38.23 38.86,37.34 UC.21/A7
  Bottom 0.406: v19.81,18.29 v23.62,18.29
ANALOG_0  (via drill 0.6)
  Top 0.406: C11.1 44.92,49.17 D8.C 43,49.67 42.56,49.67 42.29,49.4 42.29,45.09 42.8,44.58 44.32,44.58 47.62,41.27 50.29,41.27 v50.42,41.15 | 59.03,34.42 UC.A14 55.5,34.67 54.74,33.91 v50.42,33.91
  Bottom 0.305: v50.42,41.15 v50.42,33.91
ANALOG_IN
  Top 0.406: GPIO1.P1 45.74,52.17 44.45,53.47 43.1,53.47 R14.1
CAN_RX  (via drill 0.6)
  Top 0.305: 59.44,6.35 61.09,4.7 76.33,4.7 79.5,7.87
  Top 0.406: UC.4 38.98,21.09 v40.39,19.68 | 59.44,6.35 59.44,16.51 57.91,18.03 52.58,18.03 50.8,19.68 v46.86,19.68 | 79.5,7.87 TB-EXP1.P$5
  Bottom 0.406: v40.39,19.68 41.91,19.68 43.43,18.16 44.2,18.16 45.59,19.68 v46.86,19.68
CAN_TX  (via drill 0.6)
  Top 0.305: 58.67,6.1 60.71,4.06 76.71,4.06 80.39,7.75
  Top 0.406: UC.3 36.44,20.2 38.35,18.29 v40.39,18.29 | 58.67,6.1 58.67,16.13 57.66,17.14 52.2,17.14 50.67,18.54 v48.13,18.54 | 80.39,7.75 80.39,16 TB-EXP1.P$4
  Bottom 0.406: v40.39,18.29 42.16,18.29 43.43,17.02 44.2,17.02 45.72,18.54 v48.13,18.54
CS  (1 unrouted)
  Top 0.305: 61.21,23.24 58.42,23.24 58.04,22.86 58.04,20.95 57.78,20.7 55.5,20.7 UC.10
  Top 0.406: 61.98,28.07 61.98,24 61.21,23.24
FLOW_PULSE_IN_1
  Top 0.406: R7.1 35.94,11.86 35.94,10.54 36.54,9.94 FLOW1.P3 36.54,4.96 R5.1
FLOW_PULSE_IN_2
  Top 0.406: R8.1 50.16,11.87 50.16,10.54 50.54,10.16 FLOW2.P3 50.54,4.31 50.04,3.81 49.39,3.81 R6.1
GND  (via drill 0.6)  (38 unrouted)
  Top 0.305: 65.53,5.84 65.02,5.33 61.47,5.33 60.96,5.84
  Top 0.406: 38.54,11.85 C5.2 38.58,11.82 40.62,11.82 | R9.1 32.98,13.62 C7.2 33,14.97 v33.02,14.99 | 52.54,11.85 C6.2 52.58,11.82 54.62,11.82 | C8.2 45.2,13.63 R10.1 44.34,13.61 42.55,11.81 41.01,11.81 | C10.2 63.5,10.41 62.87,9.78 62.1,9.78 61.08,8.75 SPEED.P2 60.96,7.2 60.96,5.84 | SD-CARD.3 67.4,40.06 C14.2 | UC.AGND 28.82,38.99 LED2.C 29.6,40.01 28.7,40.01 25.65,43.05 | T1.E 64,17.22 D7.A 66.05,17.27 67.06,17.27 67.82,16.51 67.82,9.14 65.53,6.86 65.53,5.84 | 72.88,7.12 RESET.P1 | 30.5,54.76 31.5,55.75 35.62,55.75 R15.2 | C13.2 24.77,42.17 25.65,43.05 | 25.65,43.05 25.65,43.98 U1.1 | D6.A 51.42,46.35 C9.2 C11.2 45.92,46.27 D8.A 45.93,46.27 v45.85,44.7 | SW-HH1.A' SW-HH1.A 5.47,49.02 3.43,49.02 3.05,48.64 3.05,41.91 3.52,41.44 SW-MM1.A' | SW-MM1.A SW-MM1.A' | SW-MM1.A' 15.07,41.44 v15.11,41.4 | 73.03,7.37 73.03,11.11 C12.2
  Top 0.61: C15.2 67.38,57.2 TB-LCD.P$8 | PWR.P1 16.3,7.32 17.02,6.6 18.53,6.6 LED1.C | SD-CARD.6 70.28,32.56 71.63,33.91 71.63,39.12 70.61,40.13 69.54,40.13 SD-CARD.3
  Top 0.813: SD-CARD.6 70.82,32.56 71.75,31.62 71.75,31.5 74.55,28.7 74.55,24.77 74.17,24.38 71.13,24.38 SD-CARD.GND_SHIELD v71.13,21.84 | 73.03,7.37 RESET.P1 | C16.2 27.22,33.44 27.94,34.16 27.94,36.34 UC.AGND | C2.2 13.74,17.91
  Top 1.27: PWR.P1 14.89,9.05 15.75,9.91 15.75,11.74 D2.P$2
  Bottom 0.406: v33.02,14.99 33.02,15.24 33.27,15.49 33.53,15.49 33.78,15.75 | v45.85,44.7 47.37,44.07 47.24,43.94 | v15.11,41.4 16,41.4 16.13,41.27
  Bottom 0.813: v71.13,21.84 71.13,21.46 71.37,21.21
  other vias: 95,51.82 92.89,22.4
  pour Bottom (isolate 0.406): 98.04,0 0,0 0,59.94 98.04,59.94
GPIO_0  (via drill 0.6)  (1 unrouted)
  Top 0.406: C9.1 50.08,49.17 D6.C 52,49.67 53.09,48.59 53.09,45.09 51.93,43.68 v51.93,41.16 v51.94,41.15
  Bottom 0.406: v51.94,41.15 51.69,40.89 51.69,37.23 UC.16/A2
GPIO_1
  Top 0.406: UC.17/A3 49.16,37.22 50.67,38.73 54.61,38.73 62.48,46.61 64.52,46.61 69.34,51.44 73.28,51.44 74.68,50.04 74.68,45.97 72.77,44.07 72.77,32.51 75.82,29.46 75.82,22.35 77.09,21.08 85.22,21.08 87.12,19.18 TB-EXP1.P$2
GPIO_2  (via drill 0.6)
  Top 0.305: 81.53,7.49 77.47,3.43 60.07,3.43 57.91,5.59 57.91,6.22
  Top 0.406: v49.53,17.4 50.67,17.4 51.69,16.38 57.28,16.38 57.91,15.75 57.91,6.22 | TB-EXP1.P$3 81.53,14.61 81.53,7.49
  Bottom 0.406: 49.14,20.33 49.15,18.03 v49.53,17.4
GPIO_IN  (1 unrouted)
  Top 0.406: GPIO1.P2 49.13,52.17 50.42,53.47 51.9,53.47
LOG_BTN  (2 unrouted)
MISO
  Top 0.406: SD-CARD.7 65.56,30.13 63.12,27.69 63.12,27.18 63.37,26.92 63.75,26.92 66.04,29.21 66.55,29.21 66.8,28.96 66.8,28.45 63.25,24.89 63.25,23.75 61.34,21.84 59.43,21.84 UC.12
MOSI
  Top 0.305: 58.04,33.4 60.45,33.4
  Top 0.406: SD-CARD.2 67.07,42.56 61.09,36.58 61.09,34.04 60.45,33.4 | UC.11 51.69,27.05 51.69,30.1 54.61,33.02 57.66,33.02 58.04,33.4
N$1  (1 unrouted)
N$2
  Top 0.406: R2.1 LED1.A
N$3
  Top 0.406: LED2.A 29.72,42.89 R21.1
N$5
  Top 0.61: TB-EXP0.P$4 82.04,54.1 81.15,54.99 77.22,54.99 JP1.1
N$6
  Top 0.406: C13.1 21.46,42.17 | 21.46,42.17 20.45,43.18 20.45,43.98 U1.8 U1.7 | R18.1 22.27,41.36 21.46,42.17
N$7  (via drill 0.6)
  Top 0.406: UC.VBAT 56.12,24.52 53.21,27.43 53.21,29.46 v55.63,31.88
  Bottom 0.305: 55.5,32.13 55.5,43.28
  Bottom 0.406: v55.63,31.88 55.63,32 55.5,32.13 | 55.5,43.28 BAT.POS
N$8
  Top 0.61: TB-EXP1.P$1 JP2.1
N$9
  Top 0.406: R12.2 66.5,13.82 D7.C 65.06,14.32 64.52,14.86 63.54,14.86 T1.B C10.1
N$10  (2 unrouted)
N$12
  Top 0.813: 92.91,22.35 92.89,22.35 92.89,23.88
N$13
  Top 0.813: 95.02,51.82 93.52,51.82
N$14  (1 unrouted)
N$20  (1 unrouted)
  Top 1.27: PWR.P2 7,7.32
RESET_BTN
  Top 0.305: 66.17,23.11 65.91,23.37 65.02,23.37 61.59,19.94 59.31,19.94 58.8,19.43 53.47,19.43 51.68,21.22 UC.9
  Top 0.406: 71.12,7.27 RESET.P2 71.08,11.31 C12.1 71,15.11 67.56,18.54 67.56,21.72 66.17,23.11
RTC_HH  (via drill 0.6)  (1 unrouted)
  Top 0.406: SW-HH1.B' SW-HH1.B 5.4,52.96 3.68,52.96 2.16,51.44 2.16,41.02 4.06,39.12 v15.75,39.12 | v30.1,32.64 30.1,32.51 28.32,30.73 24.13,30.73 v19.05,35.81
  Bottom 0.406: UC.22/A8 36.44,36.82 34.16,34.54 32,34.54 v30.1,32.64 | v19.05,35.81 v15.75,39.12
RTC_MM  (via drill 0.6)  (1 unrouted)
  Top 0.406: SW-MM1.B SW-MM1.B' 14.64,43.18 v15.37,43.18 | v29.97,34.42 27.18,31.62 25.15,31.62 v20.32,36.45
  Bottom 0.406: UC.23/A9 33.9,36.44 32.89,35.43 30.99,35.43 v29.97,34.42 | v20.32,36.45 20.32,38.23 v15.37,43.18
SCK  (1 unrouted)
  Top 0.406: 63.22,45.06 59.44,41.27 59.44,40.51 59.82,40.13 60.45,40.13 64.01,43.69 64.52,43.69 64.9,43.31 64.9,42.8 64.88,42.8 UC.13
SCL
  Top 0.406: R16.1 25.15,55.72 25.15,54.86 24.5,54.22 I2C.P2 24.64,52.04 24.64,51.44 22.1,48.9 22.1,46.99 21.67,46.56 U1.6
  Bottom 0.406: TB-LCD.P$6 72.74,57.5 70.1,54.86 63.75,54.86 61.98,56.64 25.15,56.64 24.38,55.88 24.38,52.29 I2C.P2
SD_INSERTED
  Top 0.305: 52.58,23.24 52.96,22.86 52.96,20.95 53.85,20.07 58.42,20.07 58.93,20.57 61.09,20.57 64.14,23.62 64.14,24.26 65.91,26.04
  Top 0.406: SD-CARD.CARD_DET 67.01,27.13 65.91,26.04 | 52.58,23.24 35.54,23.24 UC.2
SDA
  Top 0.406: R17.1 21.72,55.66 21.72,54.36 22.5,53.57 I2C.P1 20.41,50.09 U1.5
  Bottom 0.406: TB-LCD.P$7 70.22,56.63 69.34,55.75 64.14,55.75 62.36,57.53 22.23,57.53 21.59,56.9 21.59,53.08 I2C.P1
SPEED_IN
  Top 0.406: SPEED.P1 64.47,7.32 66.42,9.27 66.42,10.34 R12.1
UC_AMB_LIGHT  (via drill 0.6)  (2 unrouted)
  Top 0.406: v41.53,43.56 41.53,50.07
  Bottom 0.406: UC.20/A6 41.52,43.55 v41.53,43.56
UC_FLOW_1  (2 unrouted)
  Top 0.406: R7.2 38.48,13.62 C5.1 39.3,13.64 40.26,14.61 40.88,14.61 | UC.5 41.52,15.11
UC_FLOW_2  (1 unrouted)
  Top 0.406: UC.6 45.21,20.83 45.21,17.4 46.99,15.62 48.64,15.62 49.53,14.73 49.53,14.28 R8.2 50.24,13.64 C6.1 54.31,13.64
UC_RX
  Top 0.406: SERIAL.P2 24.57,15.43 28.83,19.68 UC.0
UC_SCL  (via drill 0.6)
  Top 0.406: v43.94,41.4 36.96,41.4 31.88,46.48 25.69,46.48 U1.3 | R19.1 40.26,32.64 44.07,36.45 44.07,37.59 43.94,37.72 43.94,37.34 UC.19/A5
  Bottom 0.406: UC.19/A5 43.94,37.34 v43.94,41.4
UC_SDA  (via drill 0.6)
  Top 0.406: v45.72,41.4 45.72,41.53 44.7,42.55 37.21,42.55 32,47.75 25.69,47.75 U1.4 | R20.1 32.47,31.79 32.77,31.5 40.39,31.5 45.97,37.08 46.46,37.08 UC.18/A4
  Bottom 0.406: UC.18/A4 46.61,37.23 46.61,40.51 v45.72,41.4
UC_SPEED
  Top 0.406: UC.7 48,20.57 51.18,20.57 52.96,18.8 58.93,18.8 59.4,18.33 R13.1 59.94,18.29 59.94,17.27 61.45,15.77 T1.C
UC_THERM_1
  Top 0.305: 32.64,20.7 32.64,23.11
  Top 0.406: FLOW1.P4 34.54,9.4 33.02,10.92 33.02,11.88 C7.1 | C7.1 30.52,11.89 R9.2 | C7.1 33.99,11.89 34.29,12.19 34.29,19.05 32.64,20.7 | 32.64,23.11 33.66,24.13 43.69,24.13 44.07,24.51 44.07,29.59 49.53,35.05 54.61,35.05 56.76,37.2 UC.14/A0
UC_THERM_2  (via drill 0.6)  (2 unrouted)
  Top 0.406: FLOW2.P4 48.54,9.12 47.62,10.03 C8.1 48.33,11.88 48.64,12.19 48.64,14.48 48.39,14.73 46.61,14.73 43.94,17.4 v43.94,19.68 | 45.2,11.88 R10.2 | UC.15/A1 54.22,37.2 52.96,35.94 48.64,35.94 42.8,30.1 v42.8,25.27
  Bottom 0.305: 42.8,20.83 v42.8,25.27
  Bottom 0.406: v43.94,19.68 42.8,20.83
UC_TX
  Top 0.406: SERIAL.P1 26.57,14.64 31.37,19.43 UC.1
VCC
  Top 1.27: 82.92,56.15 83.44,55.63 87.76,55.63 89.53,53.85 89.53,53.34 TB-EXP0.P$1

### Text on the board
tNames: Model: RT-E / Rev: 1.0a | Copyright 2014 / M. Gross & C. Matthews
bNames: Model: RT-E / Rev: 1.0a | Copyright 2014 / M. Gross & C. Matthews